# EAGLE schematic Armaz connector board (EAGLE 7.3.0)

## Sheet 1 of 3
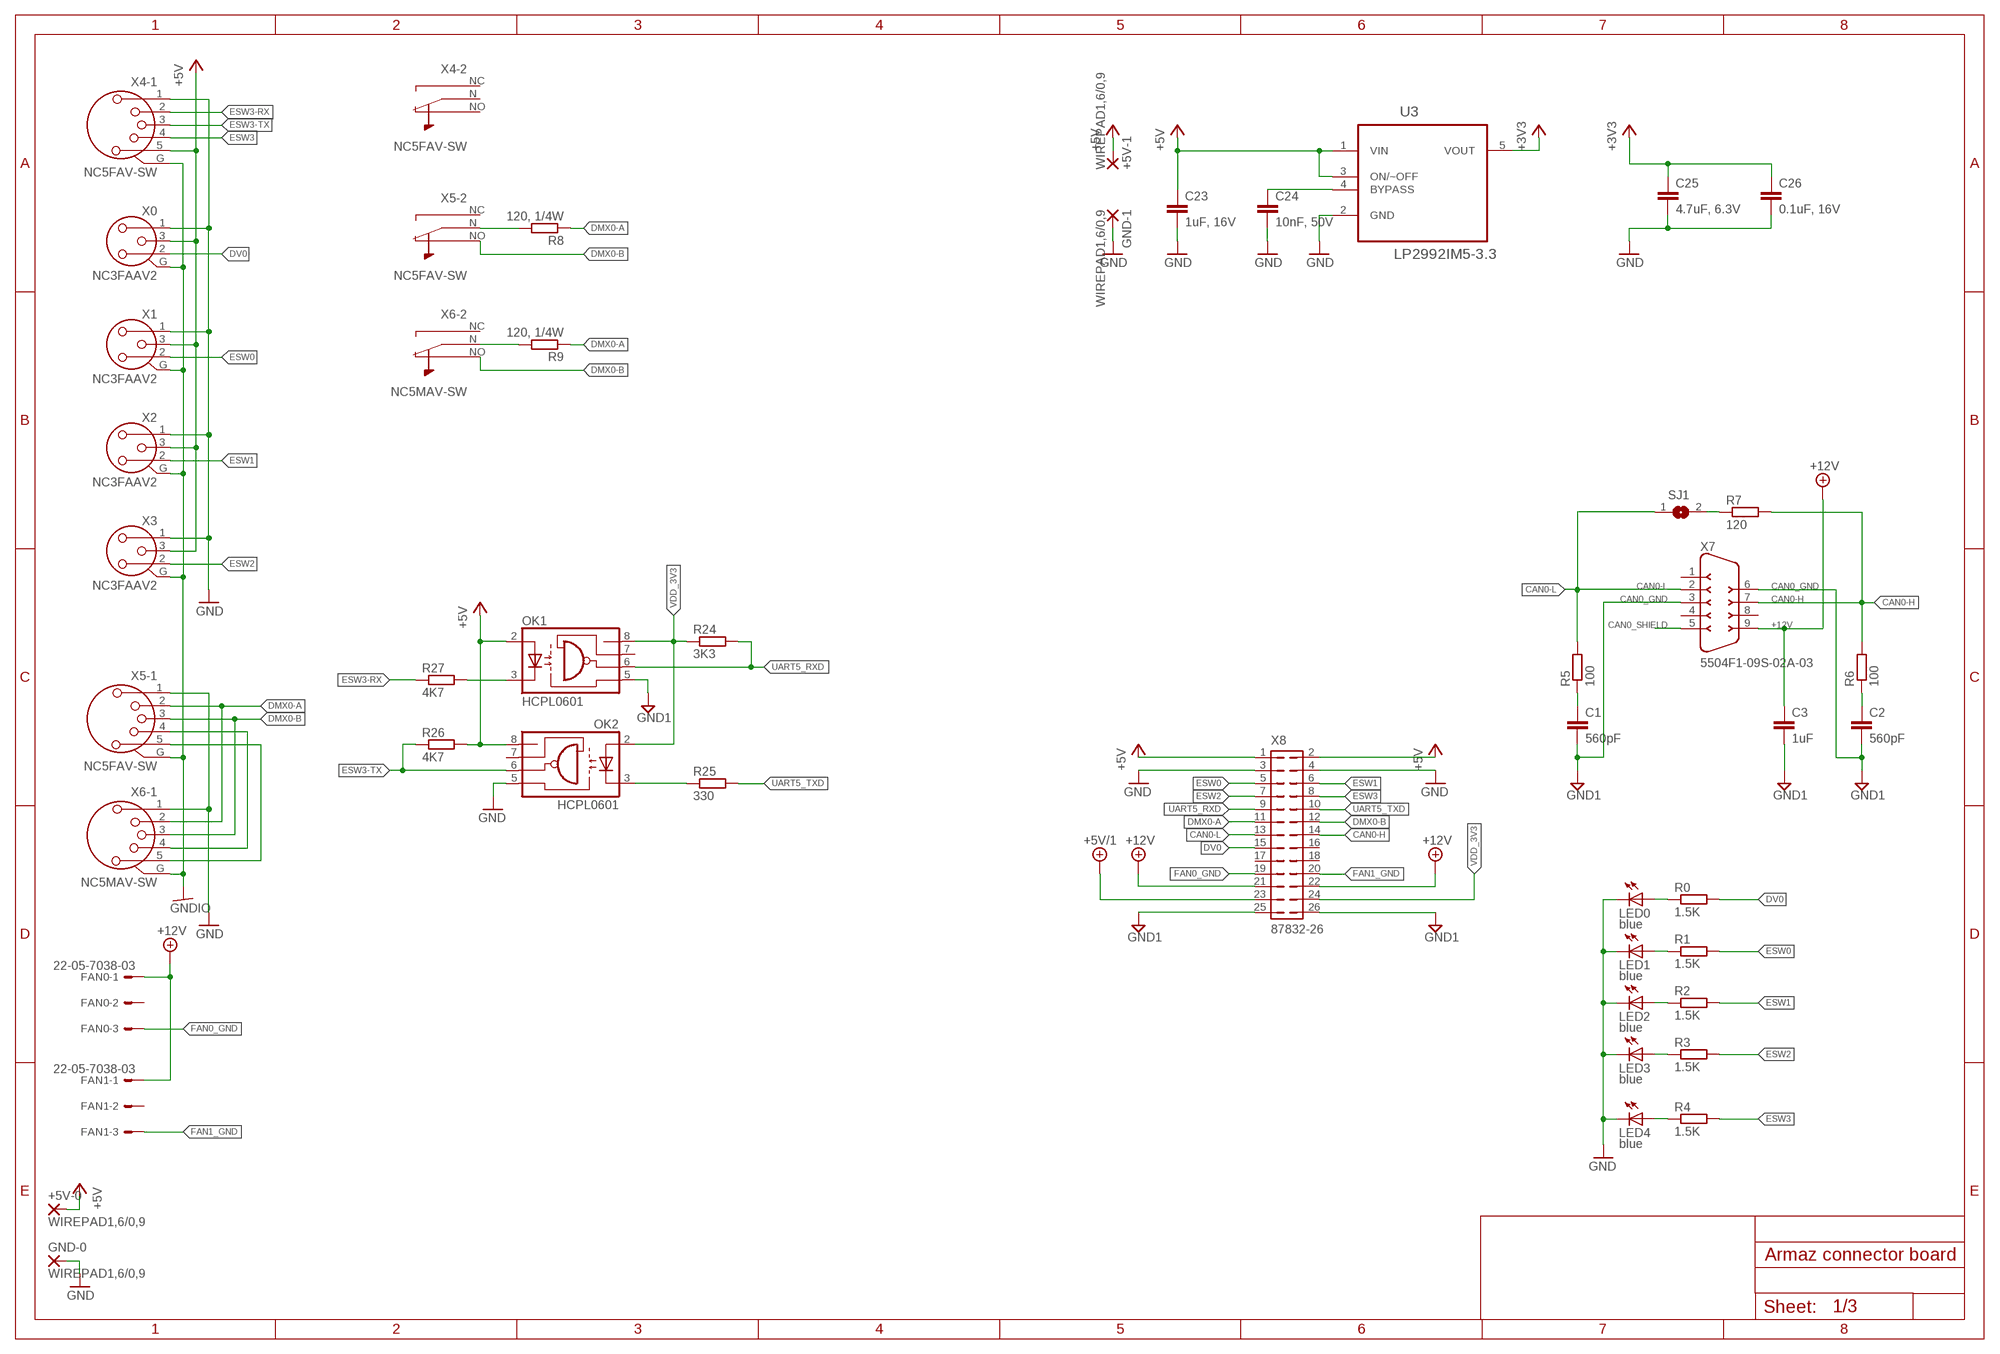
[diagram p0: schematic, sheet 1]

### Parts
+5V-0  WIREPAD1,6/0,9  [1,6/0,9]
+5V-1  WIREPAD1,6/0,9  [1,6/0,9]
C1  560pF  C-EUC0805  [C0805]
C2  560pF  C-EUC0805  [C0805]
C3  1uF  C-EUC0805  [C0805]
C23  1uF, 16V  C-EUC0402  [C0402]
C24  10nF, 50V  C-EUC0402  [C0402]
C25  4.7uF, 6.3V  C-EUC0402  [C0402]
C26  0.1uF, 16V  C-EUC0402  [C0402]
FAN0  22-05-7038-03  [7395-03]
FAN1  22-05-7038-03  [7395-03]
GND-0  WIREPAD1,6/0,9  [1,6/0,9]
GND-1  WIREPAD1,6/0,9  [1,6/0,9]
LED0  blue  LEDCHIP-LED0603  [CHIP-LED0603]
LED1  blue  LEDCHIP-LED0603  [CHIP-LED0603]
LED2  blue  LEDCHIP-LED0603  [CHIP-LED0603]
LED3  blue  LEDCHIP-LED0603  [CHIP-LED0603]
LED4  blue  LEDCHIP-LED0603  [CHIP-LED0603]
OK1  HCPL0601  [SOIC08]
OK2  HCPL0601  [SOIC08]
R0  1.5K  R-EU_R0402  [R0402]
R1  1.5K  R-EU_R0402  [R0402]
R2  1.5K  R-EU_R0402  [R0402]
R3  1.5K  R-EU_R0402  [R0402]
R4  1.5K  R-EU_R0402  [R0402]
R5  100  R-EU_R0402  [R0402]
R6  100  R-EU_R0402  [R0402]
R7  120  R-EU_R0402  [R0402]
R8  120, 1/4W  R-EU_R0402  [R0402]
R9  120, 1/4W  R-EU_R0402  [R0402]
R24  3K3  R-EU_R0402  [R0402]
R25  330  R-EU_R0402  [R0402]
R26  4K7  R-EU_R0402  [R0402]
R27  4K7  R-EU_R0402  [R0402]
SJ1  SJ  [SJ]
U3  LP2992IM5-3.3  [SOT95P284X122-5N]
X0  NC3FAAV2  [NC3FAV2]
X1  NC3FAAV2  [NC3FAV2]
X2  NC3FAAV2  [NC3FAV2]
X3  NC3FAAV2  [NC3FAV2]
X4  NC5FAV-SW  [NC5FAV-SW]
X5  NC5FAV-SW  [NC5FAV-SW]
X6  NC5MAV-SW  [NC5MAV-SW]
X7  5504F1-09S-02A-03  [5504F1-09S-02A]
X8  87832-26  [87832-26]

### Nets
+3V3 [supply2]: C25.1 C26.1 U3.5(VOUT) ; also sheet 2,3
+5V [supply]: +5V-0.1(P) +5V-1.1(P) C23.1 OK1.2(A) OK2.8(VCC) R26.2 U3.1(VIN) U3.3(ON/~OFF) X0.3 X1.3 X2.3 X3.3 X4.5 X8.1 X8.2
+5V/1 [supply]: X8.23
+12V [supply]: C3.1 FAN0.1 FAN1.1 X7.9 X8.21 X8.22
CAN0-H: R6.2 R7.2 X7.7 X8.14
CAN0-L: R5.2 SJ1.1 X7.2 X8.13
CAN0_GND: C1.2 C2.2 X7.3 X7.6 ; supply symbol labelled GND1
CAN0_SHIELD: X7.5
DMX0-A: R8.1 R9.1 X5.2 X6.2 X8.11
DMX0-B: X5.3 X5.NO(-2:NO) X6.3 X6.NO(-2:NO) X8.12
DV0: R0.2 X0.2 X8.15
ESW0: R1.2 X1.2 X8.5
ESW1: R2.2 X2.2 X8.6
ESW2: R3.2 X3.2 X8.7
ESW3: R4.2 X4.4 X8.8
ESW3-RX: R27.1 X4.2
ESW3-TX: OK2.6(VO) R26.1 X4.3
FAN0_GND [supply]: FAN0.3 X8.19
FAN1_GND [supply]: FAN1.3 X8.20
GND [supply]: C23.2 C24.2 C25.2 C26.2 GND-0.1(P) GND-1.1(P) LED0.C LED1.C LED2.C LED3.C LED4.C OK2.5(GND) U3.2(GND) X0.1 X1.1 X2.1 X3.1 X4.1 X5.1 X6.1 X8.3 X8.4 ; also sheet 2,3
GND1 [supply]: C3.2 OK1.5(GND) X8.25 X8.26
GNDIO: X0.G X1.G X2.G X3.G X4.G(-1:G) X5.G(-1:G) X6.G(-1:G)
N$1: LED1.A R1.1
N$2: LED2.A R2.1
N$3: LED3.A R3.1
N$4: LED4.A R4.1
N$5: C1.1 R5.1
N$6: C2.1 R6.1
N$7: R7.1 SJ1.2
N$8: R8.2 X5.N(-2:N)
N$15: R9.2 X6.N(-2:N)
N$16: LED0.A R0.1
N$17: OK2.3(C) R25.1
N$19: C24.1 U3.4(BYPASS)
N$20: OK1.3(C) R27.2
N$27: X5.4 X6.4
N$28: X5.5 X6.5
UART5_RXD: OK1.6(VO) R24.2 X8.9
UART5_TXD: R25.2 X8.10
VDD_3V3: OK1.8(VCC) OK2.2(A) R24.1 X8.24
Unconnected: FAN0.2 FAN1.2 OK1.7(VE) OK2.7(VE) X4.N(-2:N) X4.NC(-2:NC) X4.NO(-2:NO) X5.NC(-2:NC) X6.NC(-2:NC) X7.1 X7.4 X7.8 X8.16 X8.17 X8.18

## Sheet 2 of 3
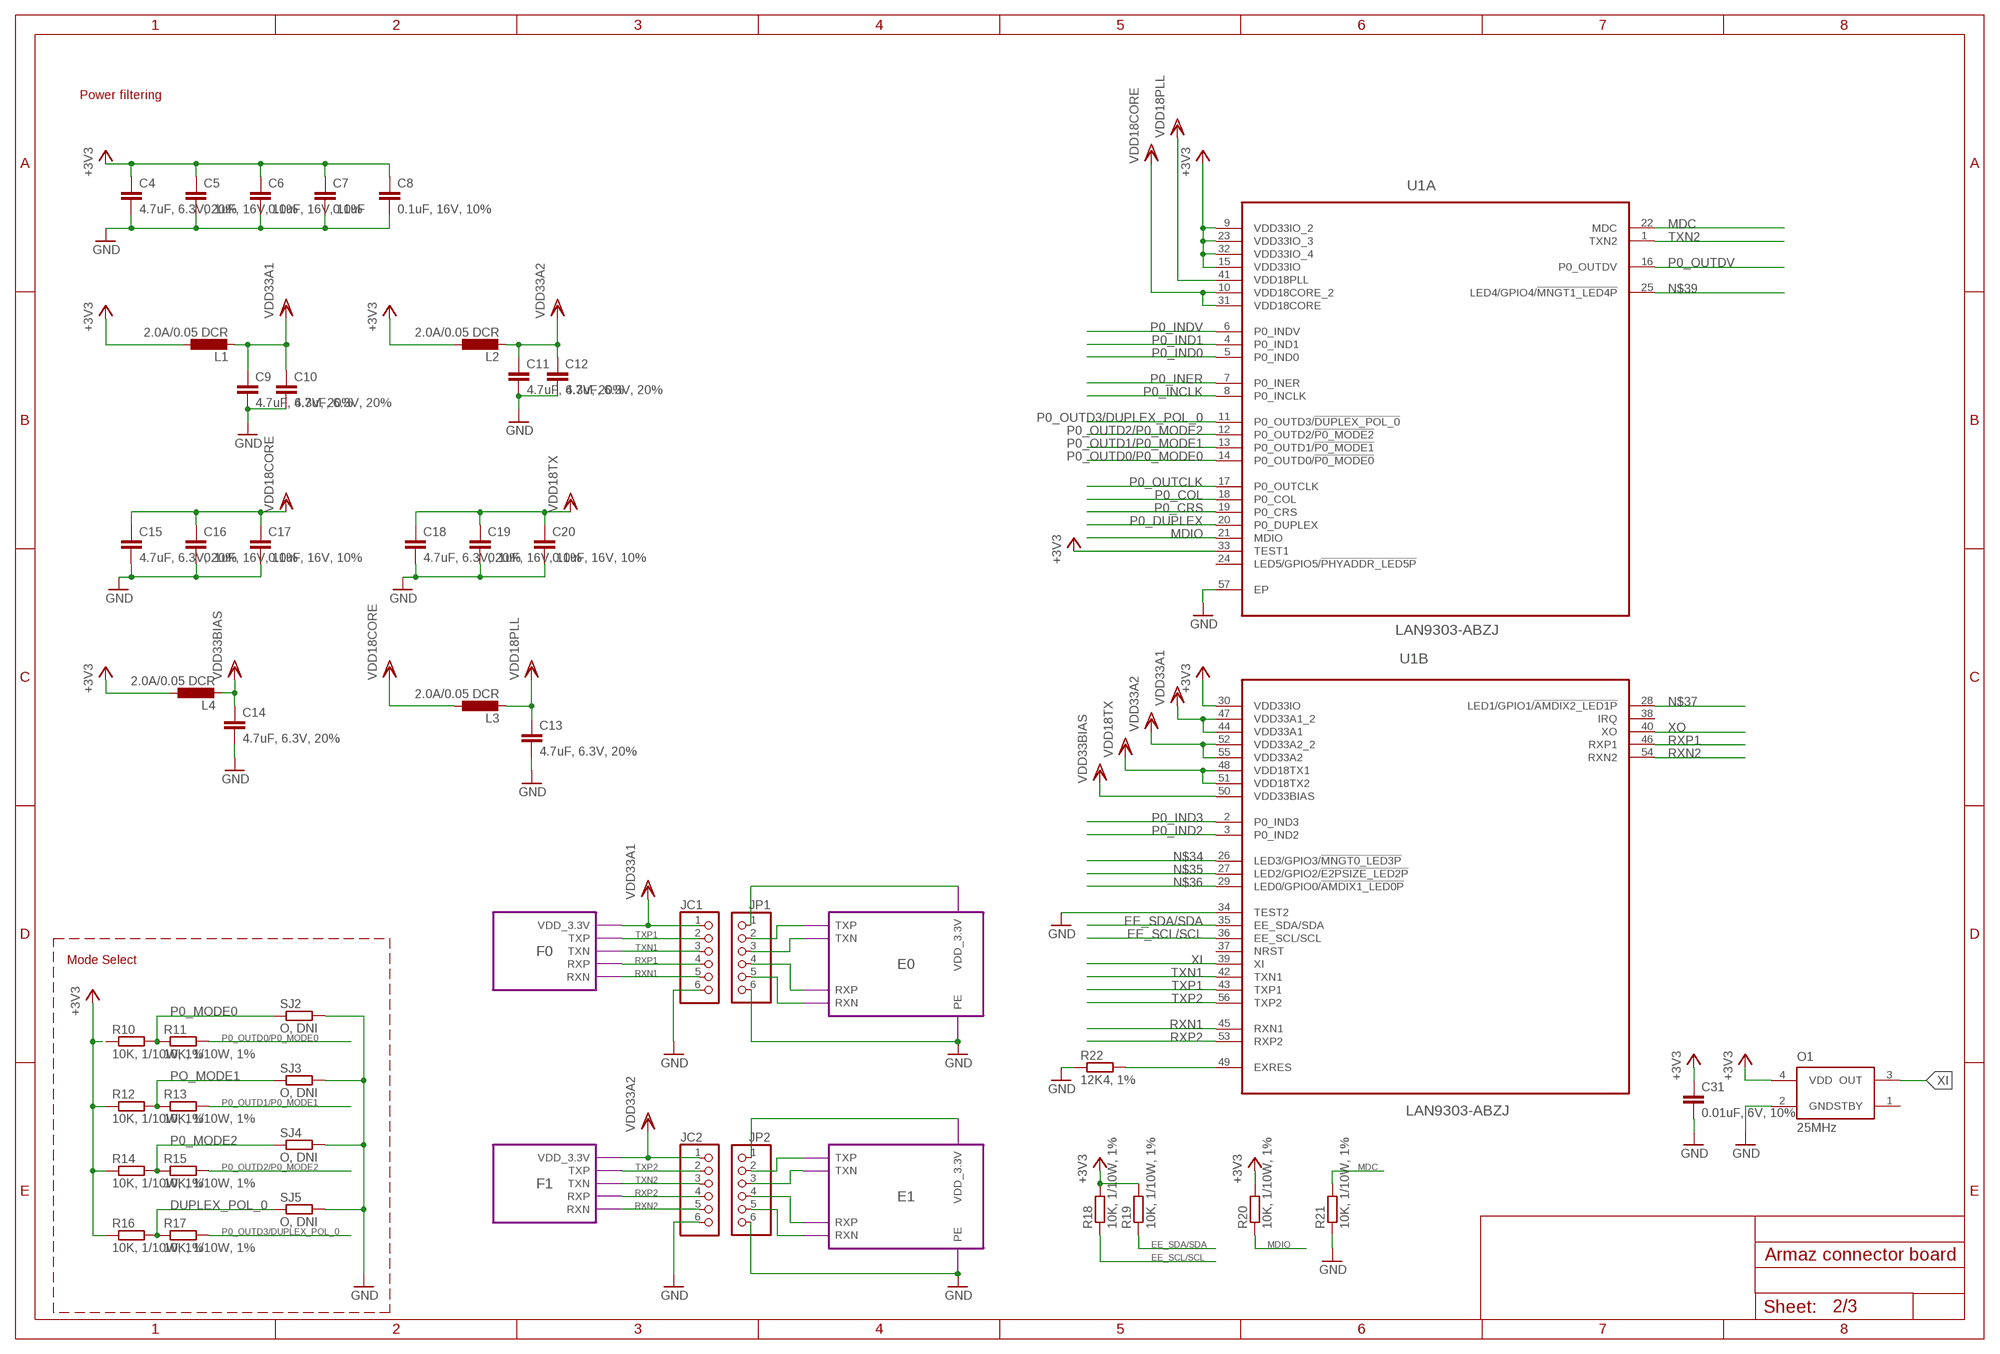
[diagram p1: schematic, sheet 2]

### Parts
C4  4.7uF, 6.3V, 20%  C-EUC0603  [C0603]
C5  0.1uF, 16V, 10%  C-EUC0603  [C0603]
C6  0.1uF, 16V, 10%  C-EUC0603  [C0603]
C7  0.1uF  C-EUC0603  [C0603]
C8  0.1uF, 16V, 10%  C-EUC0603  [C0603]
C9  4.7uF, 6.3V, 20%  C-EUC0603  [C0603]
C10  4.7uF, 6.3V, 20%  C-EUC0603  [C0603]
C11  4.7uF, 6.3V, 20%  C-EUC0603  [C0603]
C12  4.7uF, 6.3V, 20%  C-EUC0603  [C0603]
C13  4.7uF, 6.3V, 20%  C-EUC0603  [C0603]
C14  4.7uF, 6.3V, 20%  C-EUC0603  [C0603]
C15  4.7uF, 6.3V, 20%  C-EUC0603  [C0603]
C16  0.1uF, 16V, 10%  C-EUC0603  [C0603]
C17  0.1uF, 16V, 10%  C-EUC0603  [C0603]
C18  4.7uF, 6.3V, 20%  C-EUC0603  [C0603]
C19  0.1uF, 16V, 10%  C-EUC0603  [C0603]
C20  0.1uF, 16V, 10%  C-EUC0603  [C0603]
C31  0.01uF, 6V, 10%  C-EUC0603  [C0603]
JC1  PINHD-1X6  [1X06]
JC2  PINHD-1X6  [1X06]
JP1  PINHD-1X6  [1X06]
JP2  PINHD-1X6  [1X06]
L1  2.0A/0.05 DCR  L-EUL4532C  [L4532M]
L2  2.0A/0.05 DCR  L-EUL4532C  [L4532M]
L3  2.0A/0.05 DCR  L-EUL4532C  [L4532M]
L4  2.0A/0.05 DCR  L-EUL4532C  [L4532M]
O1  25MHz  ADSM1-25.0000MHZ-LC-T  [ADSM]
R10  10K, 1/10W, 1%  R-EU_R0402  [R0402]
R11  10K, 1/10W, 1%  R-EU_R0402  [R0402]
R12  10K, 1/10W, 1%  R-EU_R0402  [R0402]
R13  10K, 1/10W, 1%  R-EU_R0402  [R0402]
R14  10K, 1/10W, 1%  R-EU_R0402  [R0402]
R15  10K, 1/10W, 1%  R-EU_R0402  [R0402]
R16  10K, 1/10W, 1%  R-EU_R0402  [R0402]
R17  10K, 1/10W, 1%  R-EU_R0402  [R0402]
R18  10K, 1/10W, 1%  R-EU_R0402  [R0402]
R19  10K, 1/10W, 1%  R-EU_R0402  [R0402]
R20  10K, 1/10W, 1%  R-EU_R0402  [R0402]
R21  10K, 1/10W, 1%  R-EU_R0402  [R0402]
R22  12K4, 1%  R-EU_R0402  [R0402]
SJ2  O, DNI  R-EU_R0402  [R0402]
SJ3  O, DNI  R-EU_R0402  [R0402]
SJ4  O, DNI  R-EU_R0402  [R0402]
SJ5  O, DNI  R-EU_R0402  [R0402]
U1  LAN9303-ABZJ  [QFN50P800X800X100-57N]

### Module instances
E0 = ETHERCON
E1 = ETHERCON
F0 = FILTER
F1 = FILTER

### Nets
+3V3 [supply2]: C4.1 C5.1 C6.1 C7.1 C8.1 C31.1 L1.1 L2.1 L4.1 O1.4(VDD) R10.1 R12.1 R14.1 R16.1 R18.2 R19.2 R20.2 U1.9(A:VDD33IO_2) U1.15(A:VDD33IO) U1.23(A:VDD33IO_3) U1.30(B:VDD33IO) U1.32(A:VDD33IO_4) U1.33(A:TEST1) ; also sheet 1,3
DUPLEX_POL_0: R16.2 R17.1 SJ5.1
EE_SCL/SCL: R18.1 U1.36(B:EE_SCL/SCL)
EE_SDA/SDA: R19.1 U1.35(B:EE_SDA/SDA)
GND [supply]: C4.2 C5.2 C6.2 C7.2 C8.2 C9.2 C10.2 C11.2 C12.2 C13.2 C14.2 C15.2 C16.2 C17.2 C18.2 C19.2 C20.2 C31.2 JC1.6 JC2.6 JP1.6 JP2.6 O1.2(GND) R21.1 R22.1 SJ2.2 SJ3.2 SJ4.2 SJ5.2 U1.34(B:TEST2) U1.57(A:EP) ; port E0.PE E1.PE ; also sheet 1,3
MDC: R21.2 U1.22(A:MDC) ; also sheet 3
MDIO: R20.1 U1.21(A:MDIO) ; also sheet 3
N$21: R22.2 U1.49(B:EXRES)
N$22: JP1.2 ; port E0.TXP
N$23: JP1.3 ; port E0.TXN
N$24: JP1.4 ; port E0.RXP
N$25: JP1.5 ; port E0.RXN
N$29 [supply2]: JP2.1 ; port E1.VDD_3.3V
N$34: U1.26(B:LED3/GPIO3/!MNGT0_LED3P)
N$35: U1.27(B:LED2/GPIO2/!E2PSIZE_LED2P)
N$36: U1.29(B:LED0/GPIO0/!AMDIX1_LED0P)
N$37: U1.28(B:LED1/GPIO1/!AMDIX2_LED1P)
N$38 [supply2]: JP1.1 ; port E0.VDD_3.3V
N$39: U1.25(A:LED4/GPIO4/!MNGT1_LED4P)
N$300: JP2.2 ; port E1.TXP
N$301: JP2.3 ; port E1.TXN
N$302: JP2.4 ; port E1.RXP
N$303: JP2.5 ; port E1.RXN
P0_COL: U1.18(A:P0_COL) ; also sheet 3
P0_CRS: U1.19(A:P0_CRS) ; also sheet 3
P0_DUPLEX: U1.20(A:P0_DUPLEX)
P0_INCLK: U1.8(A:P0_INCLK) ; also sheet 3
P0_IND0: U1.5(A:P0_IND0) ; also sheet 3
P0_IND1: U1.4(A:P0_IND1) ; also sheet 3
P0_IND2: U1.3(B:P0_IND2) ; also sheet 3
P0_IND3: U1.2(B:P0_IND3) ; also sheet 3
P0_INDV: U1.6(A:P0_INDV) ; also sheet 3
P0_INER: U1.7(A:P0_INER) ; also sheet 3
P0_MODE0: R10.2 R11.1 SJ2.1
P0_MODE2: R14.2 R15.1 SJ4.1
P0_OUTCLK: U1.17(A:P0_OUTCLK) ; also sheet 3
P0_OUTD0/P0_MODE0: R11.2 U1.14(A:P0_OUTD0/!P0_MODE0) ; also sheet 3
P0_OUTD1/P0_MODE1: R13.2 U1.13(A:P0_OUTD1/!P0_MODE1)
P0_OUTD2/P0_MODE2: R15.2 U1.12(A:P0_OUTD2/!P0_MODE2) ; also sheet 3
P0_OUTD3/DUPLEX_POL_0: R17.2 U1.11(A:P0_OUTD3/!DUPLEX_POL_0) ; also sheet 3
P0_OUTDV: U1.16(A:P0_OUTDV) ; also sheet 3
PO_MODE1: R12.2 R13.1 SJ3.1
RXN1: JC1.5 U1.45(B:RXN1) ; port F0.RXN
RXN2: JC2.5 U1.54(B:RXN2) ; port F1.RXN
RXP1: JC1.4 U1.46(B:RXP1) ; port F0.RXP
RXP2: JC2.4 U1.53(B:RXP2) ; port F1.RXP
TXN1: JC1.3 U1.42(B:TXN1) ; port F0.TXN
TXN2: JC2.3 U1.1(A:TXN2) ; port F1.TXN
TXP1: JC1.2 U1.43(B:TXP1) ; port F0.TXP
TXP2: JC2.2 U1.56(B:TXP2) ; port F1.TXP
VDD18CORE [supply2]: C15.1 C16.1 C17.1 L3.1 U1.10(A:VDD18CORE_2) U1.31(A:VDD18CORE)
VDD18PLL: C13.1 L3.2 U1.41(A:VDD18PLL)
VDD18TX [supply2]: C18.1 C19.1 C20.1 U1.48(B:VDD18TX1) U1.51(B:VDD18TX2)
VDD33A1 [supply2]: C9.1 C10.1 JC1.1 L1.2 U1.44(B:VDD33A1) U1.47(B:VDD33A1_2) ; port F0.VDD_3.3V
VDD33A2 [supply2]: C11.1 C12.1 JC2.1 L2.2 U1.52(B:VDD33A2_2) U1.55(B:VDD33A2) ; port F1.VDD_3.3V
VDD33BIAS [supply2]: C14.1 L4.2 U1.50(B:VDD33BIAS)
XI: O1.3(OUT) U1.39(B:XI)
XO: U1.40(B:XO)
Unconnected: O1.1(STBY) U1.24(A:LED5/GPIO5/!PHYADDR_LED5P) U1.37(B:NRST) U1.38(B:IRQ)

### Notes on the sheet
- Power filtering
- Mode Select

## Sheet 3 of 3
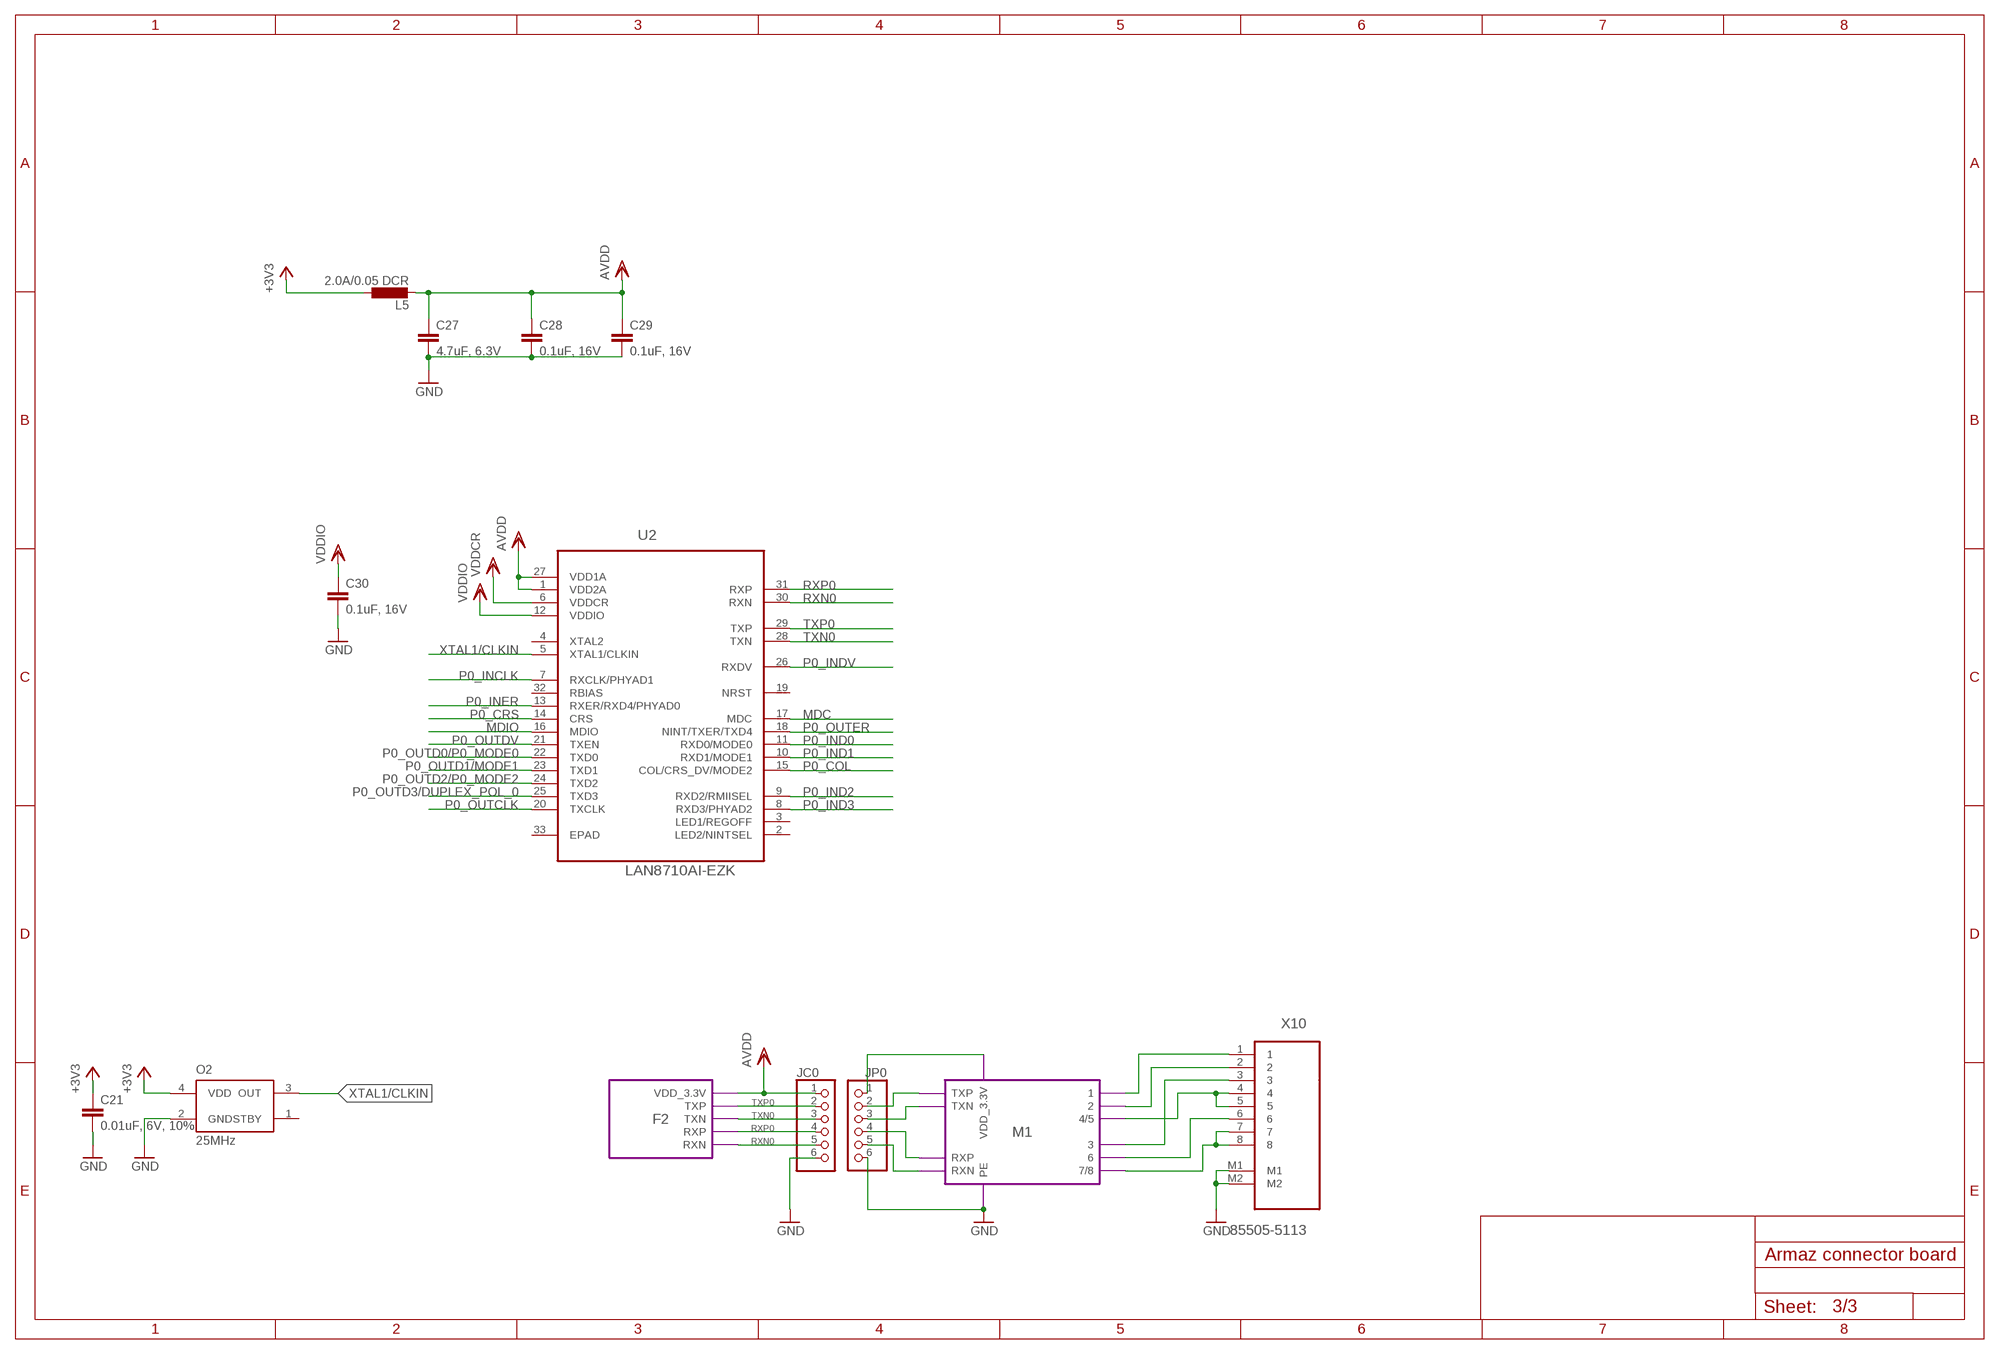
[diagram p2: schematic, sheet 3]

### Parts
C21  0.01uF, 6V, 10%  C-EUC0603  [C0603]
C27  4.7uF, 6.3V  C-EUC0603  [C0603]
C28  0.1uF, 16V  C-EUC0603  [C0603]
C29  0.1uF, 16V  C-EUC0603  [C0603]
C30  0.1uF, 16V  C-EUC0603  [C0603]
JC0  PINHD-1X6  [1X06]
JP0  PINHD-1X6  [1X06]
L5  2.0A/0.05 DCR  L-EUL4532C  [L4532M]
O2  25MHz  ADSM1-25.0000MHZ-LC-T  [ADSM]
U2  LAN8710AI-EZK  [QFN50P500X500X100-33N]
X10  85505-5113  [MOLEX_85505-5113]

### Module instances
M1 = MAGNETICS
F2 = FILTER

### Nets
+3V3 [supply2]: C21.1 L5.1 O2.4(VDD) ; also sheet 1,2
AVDD [supply2]: C27.1 C28.1 C29.1 JC0.1 L5.2 U2.1(VDD2A) U2.27(VDD1A) ; port F2.VDD_3.3V
GND [supply]: C21.2 C27.2 C28.2 C29.2 C30.2 JC0.6 JP0.6 O2.2(GND) X10.M1 X10.M2 ; port M1.PE ; also sheet 1,2
MDC: U2.17(MDC) ; also sheet 2
MDIO: U2.16(MDIO) ; also sheet 2
N$9: X10.1 ; port M1.1
N$10: X10.2 ; port M1.2
N$11: X10.3 ; port M1.3
N$12: X10.4 X10.5 ; port M1.4/5
N$13: X10.7 X10.8 ; port M1.7/8
N$14: X10.6 ; port M1.6
N$26: JP0.4 ; port M1.RXP
N$30 [supply2]: JP0.1 ; port M1.VDD_3.3V
N$31: JP0.3 ; port M1.TXN
N$32: JP0.2 ; port M1.TXP
N$33: JP0.5 ; port M1.RXN
P0_COL: U2.15(COL/CRS_DV/MODE2) ; also sheet 2
P0_CRS: U2.14(CRS) ; also sheet 2
P0_INCLK: U2.7(RXCLK/PHYAD1) ; also sheet 2
P0_IND0: U2.11(RXD0/MODE0) ; also sheet 2
P0_IND1: U2.10(RXD1/MODE1) ; also sheet 2
P0_IND2: U2.9(RXD2/RMIISEL) ; also sheet 2
P0_IND3: U2.8(RXD3/PHYAD2) ; also sheet 2
P0_INDV: U2.26(RXDV) ; also sheet 2
P0_INER: U2.13(RXER/RXD4/PHYAD0) ; also sheet 2
P0_OUTCLK: U2.20(TXCLK) ; also sheet 2
P0_OUTD0/P0_MODE0: U2.22(TXD0) ; also sheet 2
P0_OUTD1/MODE1: U2.23(TXD1)
P0_OUTD2/P0_MODE2: U2.24(TXD2) ; also sheet 2
P0_OUTD3/DUPLEX_POL_0: U2.25(TXD3) ; also sheet 2
P0_OUTDV: U2.21(TXEN) ; also sheet 2
P0_OUTER: U2.18(NINT/TXER/TXD4)
RXN0: JC0.5 U2.30(RXN) ; port F2.RXN
RXP0: JC0.4 U2.31(RXP) ; port F2.RXP
TXN0: JC0.3 U2.28(TXN) ; port F2.TXN
TXP0: JC0.2 U2.29(TXP) ; port F2.TXP
VDDCR: U2.6(VDDCR)
VDDIO: C30.1 U2.12(VDDIO)
XTAL1/CLKIN: O2.3(OUT) U2.5(XTAL1/CLKIN)
Unconnected: O2.1(STBY) U2.2(LED2/NINTSEL) U2.3(LED1/REGOFF) U2.4(XTAL2) U2.19(NRST) U2.32(RBIAS) U2.33(EPAD)

## Library data of the parts
+5V-0 +5V-1 GND-0 GND-1 = wirepad:WIREPAD: Wire PAD connect wire on PCB; OC_FARNELL: unknown
C1 C2 = rcl:C-EU: CAPACITOR, European symbol; MF: MULTICOMP; MPN: MC0805B561K500CT; OC_FARNELL: 1759219
C3 = rcl:C-EU: CAPACITOR, European symbol; MF: MULTICOMP; MPN: MC0805F105Z250CT; OC_FARNELL: 1759429
C4 C9-C15 C18 C25 = rcl:C-EU: CAPACITOR, European symbol; MF: MURATA; MPN: GRM155R60J475ME47D; OC_FARNELL: 2426952
C5-C8 C16 C17 C19 C20 C26 C28-C30 = rcl:C-EU: CAPACITOR, European symbol; MF: MULTICOMP; MPN: MC0603B104K160CT; OC_FARNELL: 1759016
C21 C31 = rcl:C-EU: CAPACITOR, European symbol; MF: MULTICOMP; MPN: MC0603B103K160CT; OC_FARNELL: 1759003
C23 = rcl:C-EU: CAPACITOR, European symbol; MF: MULTICOMP; MPN: MC0603X105K160CT; OC_FARNELL: 1759407
C24 = rcl:C-EU: CAPACITOR, European symbol; MF: MULTICOMP; MPN: MC0402F103Z500CT; OC_FARNELL: 1759001
C27 = rcl:C-EU: CAPACITOR, European symbol; MF: MULTICOMP; MPN: MC0603X475K6R3CT; OC_FARNELL: 2320811
FAN0 FAN1 = con-molex:22-?-03: CONNECTOR wire to board 2.54 mm (.1 inch) pitch header; MF: MOLEX; MPN: 22-05-7038; OC_FARNELL: 9731610; OC_NEWARK: unknown
JC0 JC1 JC2 JP0 JP1 JP2 = pinhead:PINHD-1X6: PIN HEADER; MF: MULTICOMP; MPN: MC34751; OC_FARNELL: 1593430
L1-L5 = rcl:L-EU: INDUCTOR, European symbol; MF: MURATA; MPN: LQH43PN2R2M26L; OC_FARNELL: 2219282
LED0 LED1-LED4 = led:LED: LED OSRAM: - CHIPLED LG R971, LG N971, LY N971, LG Q971, LY Q971, LO R971, LY R971 LH N974, LH R974 LS Q976, LO Q976, LY Q976 LO Q996 - Hyper CHIPLED LW Q18S LB Q993, LB Q99A, LB R99A - SideLED LS A670, LO A670, LY A670, LG A670, LP A670 LB A673, LV A673, LT A673, LW A673 LH A674 LY A675 LS A676, LA A676, LO A676, LY A676, LW A676 LS A679, LY A679, LG A679 - Hyper Micro SIDELED® LS Y876, LA Y876, LO Y876, LY Y876 LT Y87S - SmartLED LW L88C, LW L88S LB L89C, LB L89S, LG L890 LS L89K, LO L89K, LY L89K LS L896, LA L896, LO L896, LY L896 - TOPLED LS T670, LO T670, LY T670, LG T670, LP T670 LSG T670, LSP T670, LSY T670, LOP T670, LYG T670 LG T671, LOG T671, LSG T671 LB T673, LV T673, LT T673, LW T673 LH T674 LS T676, LA T676, LO T676, LY T676, LB T676, LH T676, LSB T676, LW T676 LB T67C, LV T67C, LT T67C, LS T67K, LO T67K, LY T67K, LW E67C LS E67B, LA E67B, LO E67B, LY E67B, LB E67C, LV E67C, LT E67C LW T67C LS T679, LY T679, LG T679 LS T770, LO T770, LY T770, LG T770, LP T770 LB T773, LV T773, LT T773, LW T773 LH T774 LS E675, LA E675, LY E675, LS T675 LS T776, LA T776, LO T776, LY T776, LB T776 LHGB T686 LT T68C, LB T68C - Hyper Mini TOPLED® LB M676 - Mini TOPLED Santana® LG M470 LS M47K, LO M47K, LY M47K Source: http://www.osram.convergy.de LUXEON: - LUMILED® LXK2-PW12-R00, LXK2-PW12-S00, LXK2-PW14-U00, LXK2-PW14-V00 LXK2-PM12-R00, LXK2-PM12-S00, LXK2-PM14-U00 LXK2-PE12-Q00, LXK2-PE12-R00, LXK2-PE12-S00, LXK2-PE14-T00, LXK2-PE14-U00 LXK2-PB12-K00, LXK2-PB12-L00, LXK2-PB12-M00, LXK2-PB14-N00, LXK2-PB14-P00, LXK2-PB14-Q00 LXK2-PR12-L00, LXK2-PR12-M00, LXK2-PR14-Q00, LXK2-PR14-R00 LXK2-PD12-Q00, LXK2-PD12-R00, LXK2-PD12-S00 LXK2-PH12-R00, LXK2-PH12-S00 LXK2-PL12-P00, LXK2-PL12-Q00, LXK2-PL12-R00 Source: www.luxeon.com KINGBRIGHT: KA-3528ASYC Source: www.kingbright.com; MF: MULTICOMP; MPN: OVS-0603; OC_FARNELL: 1716770
O1 O2 = crystal:ADSM?; MF: ABRACON; MPN: ASDM1-25.000MHZ-LC-T; OC_FARNELL: 2467877
OK1 OK2 = optocoupler:HCPL0601: HEWLETT PACKARD OPTO COUPLER; MF: AVAGO TECHNOLOGIES; MPN: HCPL-0601-000E; OC_FARNELL: 9995102; OC_NEWARK: 88H7776
R0 R1-R4 = rcl:R-EU_: RESISTOR, European symbol; MF: MULTICOMP; MPN: MCMR04X1501FTL; OC_FARNELL: 2072645
R5 R6 = rcl:R-EU_: RESISTOR, European symbol; MF: MULTICOMP; MPN: MC00625W04021100R; OC_FARNELL: 1358015
R7 = rcl:R-EU_: RESISTOR, European symbol; MF: MULTICOMP; MPN: MC00625W04021120R; OC_FARNELL: 1358018
R8 R9 = rcl:R-EU_: RESISTOR, European symbol; MF: MULTICOMP; MPN: MCHP05W4F1200T5E; OC_FARNELL: 1576447
R10-R21 = rcl:R-EU_: RESISTOR, European symbol; MF: MULTICOMP; MPN: MCMR04X1002FTL; OC_FARNELL: 2072517
R22 = rcl:R-EU_: RESISTOR, European symbol; MF: MULTICOMP; MPN: MC00625W0402112K4; OC_FARNELL: 1803145
R24 = rcl:R-EU_: RESISTOR, European symbol; MF: MULTICOMP; MPN: MC00625W040213K3; OC_FARNELL: 1358056
R25 = rcl:R-EU_: RESISTOR, European symbol; MF: MULTICOMP; MPN: MC00625W04021330R; OC_FARNELL: 1358028
R26 R27 = rcl:R-EU_: RESISTOR, European symbol; MF: MULTICOMP; MPN: MC00625W040214K7; OC_FARNELL: 1358060
SJ1 = jumper:SJ: SMD solder JUMPER; OC_FARNELL: unknown
SJ2-SJ5 = rcl:R-EU_: RESISTOR, European symbol; OC_FARNELL: unknown
U1 = Microchip_By_element14_Batch_1:LAN9303-ABZJ: Ethernet Switch,56VQFN; MF: MICROCHIP; MPN: LAN9303-ABZJ; OC_FARNELL: 2292583; OC_NEWARK: 66W1986; PACKAGE: 56VQFN; SUPPLIER: MICROCHIP
U2 = Microchip_By_element14_Batch_1:LAN8710AI-EZK: IC, MII/RMII 10/100 ENET TRX, 32VQFN; MF: MICROCHIP; MPN: LAN8710AI-EZK; OC_FARNELL: 2292576; OC_NEWARK: 66W1983; PACKAGE: 32VQFN; SUPPLIER: Microchip
U3 = NSC_By_element14_Batch_1.1:LP2992IM5-3.3: Low-Dropout Regulator; MF: TEXAS INSTRUMENTS; MPN: LP2992IM5-3.3/NOPB; OC_FARNELL: 1469141; OC_NEWARK: 41K7301; PACKAGE: SOT23-5; SUPPLIER: National Semiconductor
X0 X1-X3 = con-neutrik_ag:NC3: Neutrik Audio Connector XLR SERIES Stereo 1/4" jack Source: www.neutrik.com/; MF: NEUTRIK; MPN: NC3FAAV2; OC_FARNELL: 1310038
X4 X5 = con-neutrik_ag:NC5?-SW: Neutrik Audio Connector XLR SERIES Stereo 1/4" jack Source: www.neutrik.com/; MF: NEUTRIK; MPN: NC5FAV-SW; OC_FARNELL: 1310093
X6 = con-neutrik_ag:NC5?-SW: Neutrik Audio Connector XLR SERIES Stereo 1/4" jack Source: www.neutrik.com/; MF: NEUTRIK; MPN: NC5MAV-SW; OC_FARNELL: 1310098
X7 = con-multicomp:5504F1-09S-02A-03; MF: MULTICOMP; MPN: 5504F1-09S-02A-03; OC_FARNELL: 1848372
X8 = con-molex:87832-26: Milli-Grid Header 2.00mm (.079") Pitch; MF: MOLEX; MPN: 87832-2620; OC_FARNELL: 2313712; OC_NEWARK: unknown
X10 = Molex-8550x-xxxx:85505-5113: CONNECTOR, RJ45, JACK, 8P8C, 1PORT, CAT5E; MF: MOLEX; MPN: 85505-5113; OC_FARNELL: 1560163; OC_NEWARK: 96M8715; PACKAGE: RJ45, JACK, 8P8C; SUPPLIER: Molex

## Module MAGNETICS
Ports: TXP(io) TXN(io) RXP(io) RXN(io) PE(pwr) 1(io) 2(io) 4/5(io) 3(io) 6(io) 7/8(io) VDD_3.3V(pwr)
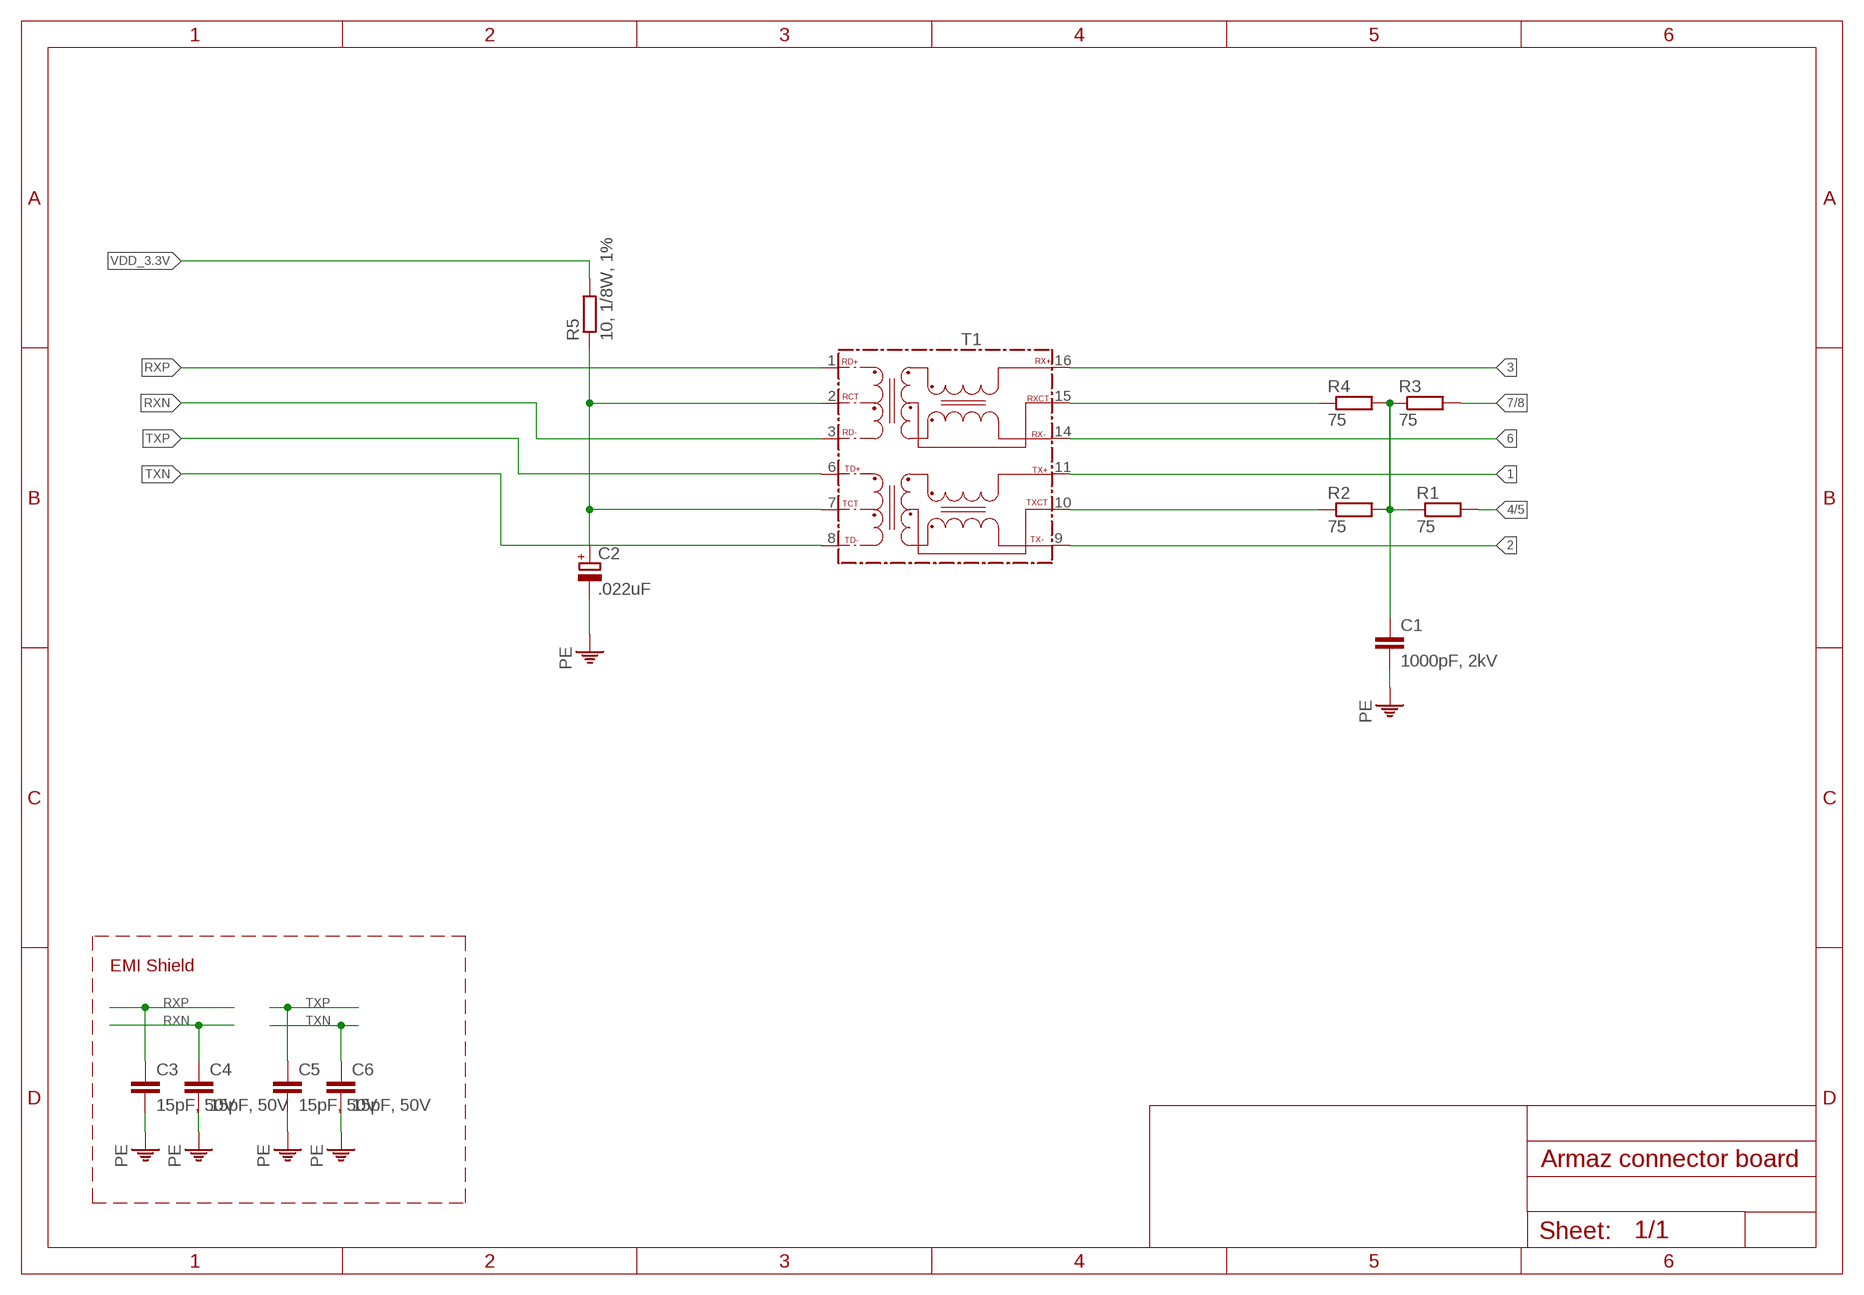
[diagram p3: schematic, module MAGNETICS, sheet 1]

### Parts
C1  1000pF, 2kV  C-EUC1206  [C1206]
C2  .022uF  CPOL-EUSMCB  [SMC_B]
C3  15pF, 50V  C-EUC0504  [C0504]
C4  15pF, 50V  C-EUC0504  [C0504]
C5  15pF, 50V  C-EUC0504  [C0504]
C6  15pF, 50V  C-EUC0504  [C0504]
R1  75  R-EU_R0402  [R0402]
R2  75  R-EU_R0402  [R0402]
R3  75  R-EU_R0402  [R0402]
R4  75  R-EU_R0402  [R0402]
R5  10, 1/8W, 1%  R-EU_R0402  [R0402]
T1  WE-LAN-10/100-BASE-T,749010012  [749010012]

### Nets
1: T1.11(TX+)
2: T1.9(TX-)
3: T1.16(RX+)
4/5: R1.2
6: T1.14(RX-)
7/8: R3.2
N$1: C2.+ R5.1 T1.2(RCT) T1.7(TCT)
N$2: R2.1 T1.10(TXCT)
N$3: R4.1 T1.15(RXCT)
N$8: C1.1 R1.1 R2.2 R3.1 R4.2
PE: C1.2 C2.- C3.2 C4.2 C5.2 C6.2
RXN: C4.1 T1.3(RD-)
RXP: C3.1 T1.1(RD+)
TXN: C6.1 T1.8(TD-)
TXP: C5.1 T1.6(TD+)
VDD_3.3V: R5.2

### Notes on the sheet
- EMI Shield

### Library data of the parts
C1 = rcl:C-EU: CAPACITOR, European symbol; MF: MULTICOMP; MPN: MC1206B102K202CT; OC_FARNELL: 1855909
C2 = rcl:CPOL-EU: POLARIZED CAPACITOR, European symbol; MF: MULTICOMP; MPN: MC0805B223K500CT; OC_FARNELL: 1759252
C3-C6 = rcl:C-EU: CAPACITOR, European symbol; MF: MULTICOMP; MPN: MC0402N150J500CT; OC_FARNELL: 1758945
R1-R4 = rcl:R-EU_: RESISTOR, European symbol; MF: MULTICOMP; MPN: MC00625W0402175R; OC_FARNELL: 1358012
R5 = rcl:R-EU_: RESISTOR, European symbol; MF: MULTICOMP; MPN: MCHP03W8F100JT5E; OC_FARNELL: 1576250
T1 = WE-LAN-10_100-BASE-T_749010012:WE-LAN-10/100-BASE-T,749010012: LAN-Transformer WE-LAN 10/100 Base T - Compliant with IEEE 802.3 standards - SMD -- Ethernet -- Power over Ethernet -- 1 Gigabit Ethernet -- Compliant with most IC's for ethernet applications like Intel, AMD, Globespan and Realtek -- Hub, Router, Switch; MF: WURTH ELEKTRONIK; MPN: 749010012; OC_FARNELL: 1636345; OC_NEWARK: unknown; PACKAGE: 10/100/Base-T; SUPPLIER: Wuerth Elektronik

## Module ETHERCON
Ports: PE(pwr) VDD_3.3V(pwr) TXP(io) TXN(io) RXP(io) RXN(io)
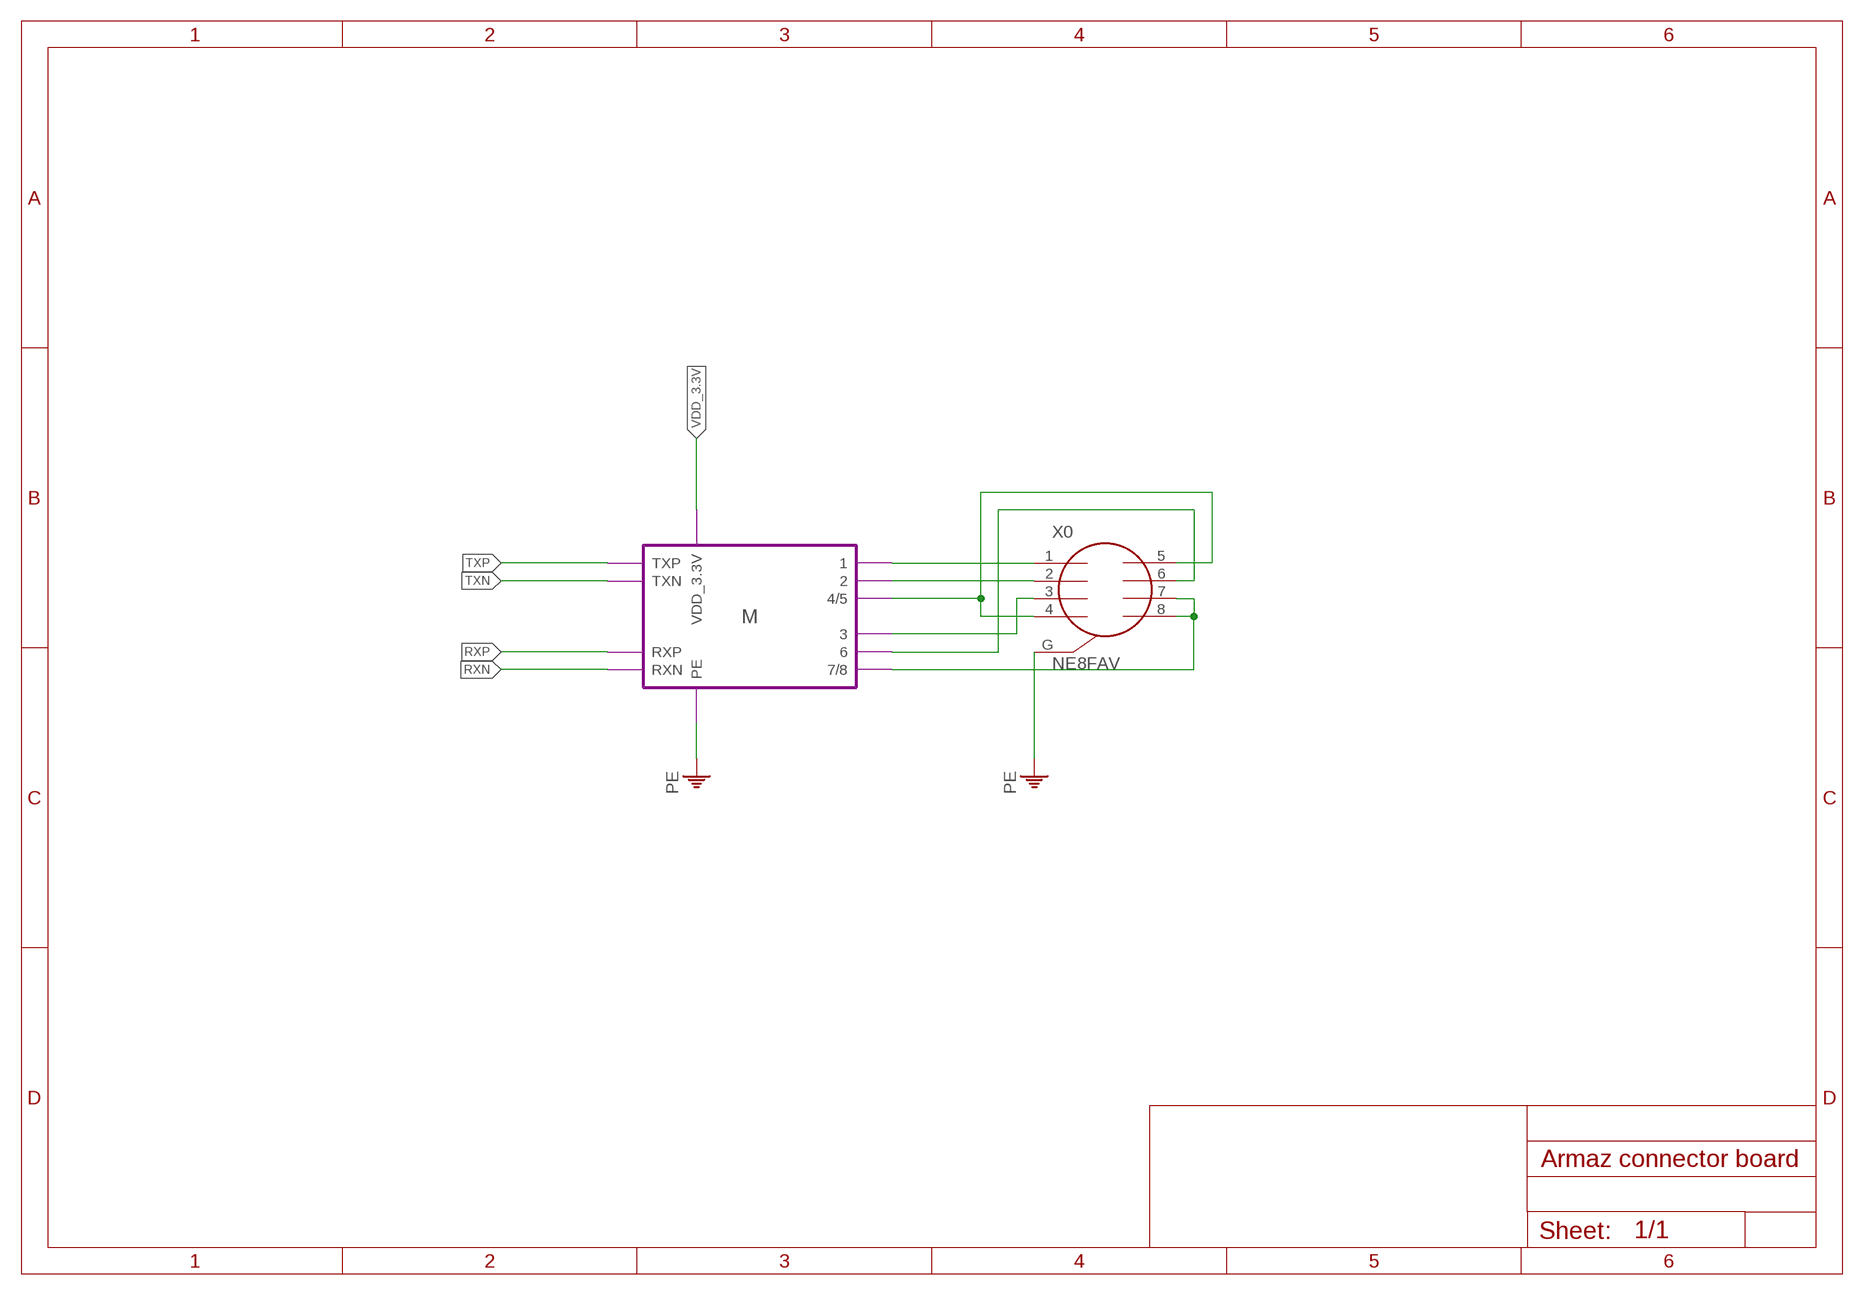
[diagram p4: schematic, module ETHERCON, sheet 1]

### Parts
X0  NE8FAV  [NE8FAV]

### Module instances
M = MAGNETICS

### Nets
N$1: X0.1 ; port M.1
N$2: X0.2 ; port M.2
N$3: X0.3 ; port M.3
N$4: X0.6 ; port M.6
N$5: X0.4 X0.5 ; port M.4/5
N$6: X0.7 X0.8 ; port M.7/8
PE: X0.G ; port M.PE
RXN: port M.RXN
RXP: port M.RXP
TXN: port M.TXN
TXP: port M.TXP
VDD_3.3V: port M.VDD_3.3V

### Library data of the parts
X0 = con-neutrik_ag:NE8; MF: NEUTRIK; MPN: NE8FAV; OC_FARNELL: 1202031

## Module FILTER
Ports: TXP(io) TXN(io) RXP(io) RXN(io) VDD_3.3V(io)
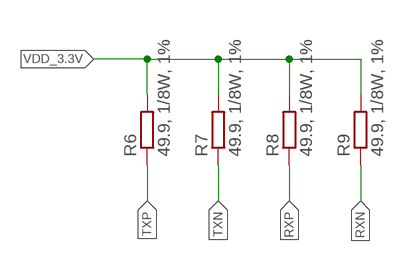
[diagram p5: schematic, module FILTER, sheet 1]

### Parts
R6  49.9, 1/8W, 1%  R-EU_R0402  [R0402]
R7  49.9, 1/8W, 1%  R-EU_R0402  [R0402]
R8  49.9, 1/8W, 1%  R-EU_R0402  [R0402]
R9  49.9, 1/8W, 1%  R-EU_R0402  [R0402]

### Nets
RXN: R9.1
RXP: R8.1
TXN: R7.1
TXP: R6.1
VDD_3.3V: R6.2 R7.2 R8.2 R9.2

### Library data of the parts
R6-R9 = rcl:R-EU_: RESISTOR, European symbol; MF: MULTICOMP; MPN: MCMR04X49R9FTL; OC_FARNELL: 2073090

## Net classes
0 default: width 0.152 mm, drill 0.2 mm, clearance 0.205 mm
1 supply: width 0.406 mm, drill 0.35 mm, clearance 0.205 mm to class 0, clearance 0.205 mm
2 supply2: width 0.203 mm, drill 0.25 mm, clearance 0.205 mm to class 0, clearance 0.205 mm to class 1, clearance 0.205 mm